# Altium schematic sheet Connectors.SchDoc: FIoT Rev 2.0
size A4; ApprovedBy: Patrick Magee; CheckedBy: Patrick Magee; Author: Patrick Magee; DrawnBy: Patrick Magee; Engineer: Patrick Magee; Organization: Lumen Electronics; DocumentNumber: 18072022 - 1; Revision: 0; SheetNumber: 1; SheetTotal: 8; ENG_APP_DATE: --/--/--; DSN_APP_DATE: --/--/--; CHK_APP_DATE: --/--/--; REV: 1.1
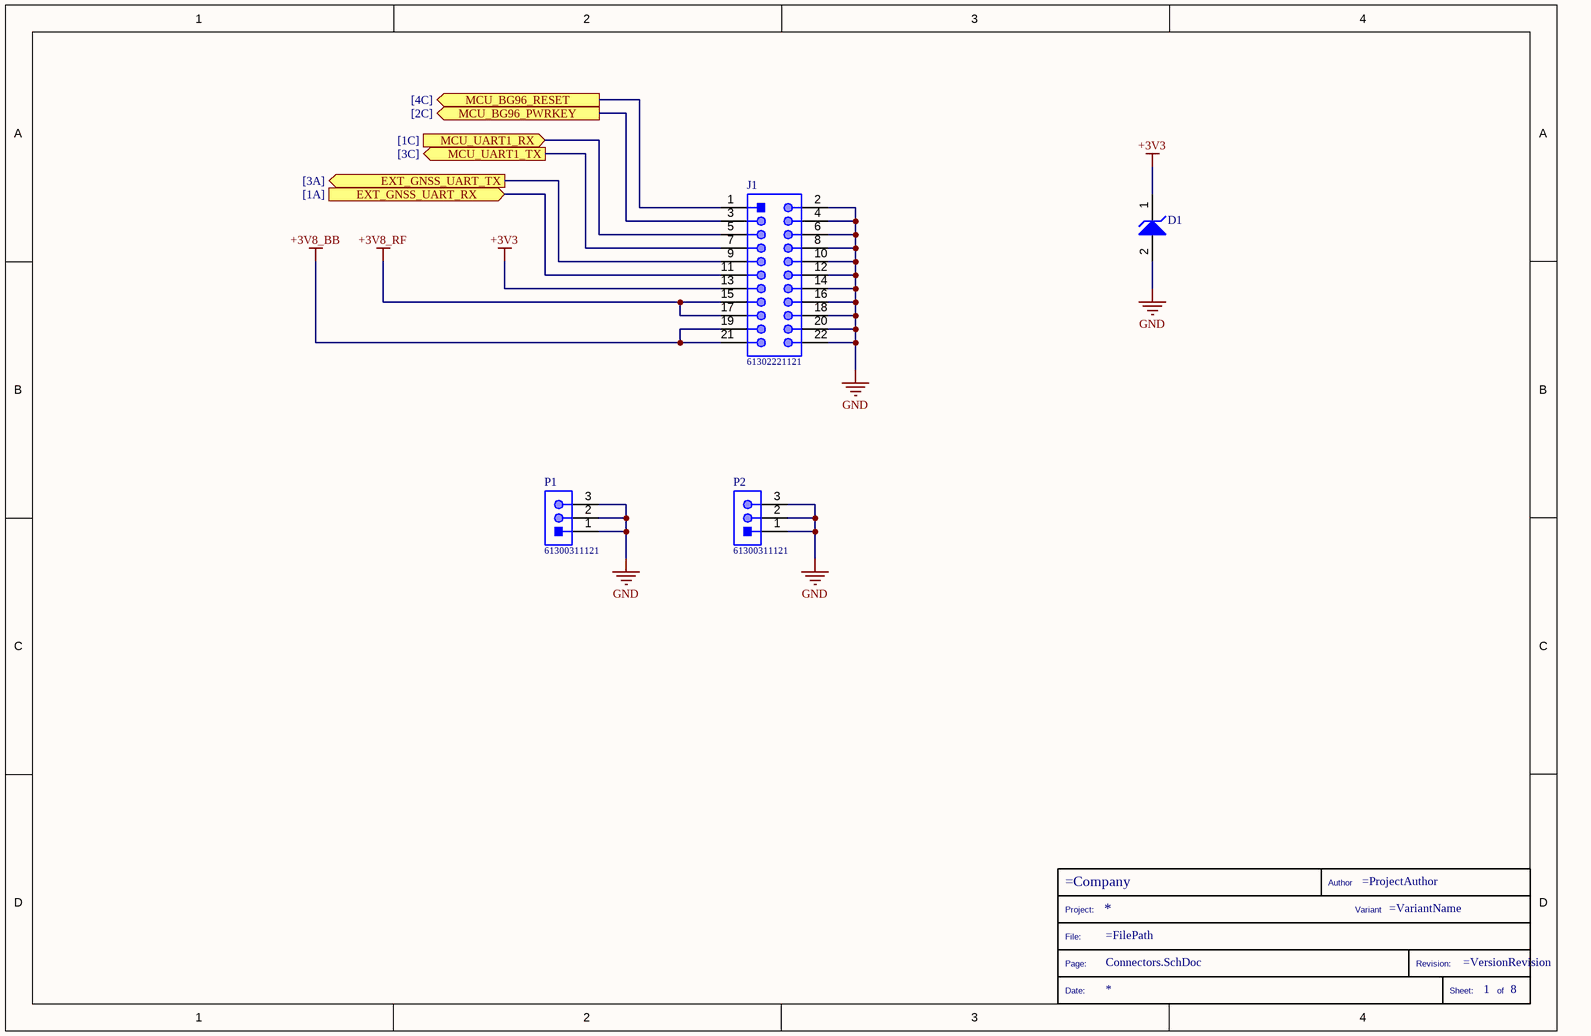
[diagram p0: Connectors.SchDoc]

## Parts
*  TitleBlock  (value not drawn)  (graphical)
D1  ESD9X3.3ST5G  [ONSC-SOD-923-2-514AA-01_V]  (value not drawn)
J1  61302221121  [61302221121]
P1  61300311121  [61300311121]
P2  61300311121  [61300311121]

## Ports
EXT_GNSS_UART_RX (in, see [1A]), EXT_GNSS_UART_TX (out, see [3A]), MCU_BG96_PWRKEY (out, see [2C]), MCU_BG96_RESET (out, see [4C]), MCU_UART1_RX (in, see [1C]), MCU_UART1_TX (out, see [3C])

## Nets
+3V3: D1.1(K) J1.13
+3V8_BB: J1.19 J1.21
+3V8_RF: J1.15 J1.17
GND: D1.2(A) J1.2 J1.4 J1.6 J1.8 J1.10 J1.12 J1.14 J1.16 J1.18 J1.20 J1.22 P1.1 P1.2 P1.3 P2.1 P2.2 P2.3
EXT_GNSS_UART_RX: J1.11 ; port EXT_GNSS_UART_RX
EXT_GNSS_UART_TX: J1.9 ; port EXT_GNSS_UART_TX
MCU_BG96_PWRKEY: J1.3 ; port MCU_BG96_PWRKEY
MCU_BG96_RESET: J1.1 ; port MCU_BG96_RESET
MCU_UART1_RX: J1.5 ; port MCU_UART1_RX
MCU_UART1_TX: J1.7 ; port MCU_UART1_TX

## Notes on the sheet
- DWG. NO.
- REV.
- SHT.
- THIS DOCUMENT AND THE DATA DISCLOSED HEREIN OR HEREWITH IS THE PROPERTY OF ALTIUM LIMITED AND MAY BE FREELY DISTRIBUTED IN WHOLE. NO RIGHTS ARE RESERVED OR EXPRESS OR IMPLIED WARANTEE GIVEN.
- REVISION
- DESCRIPTION
- DATE
- APPROVED
- ENG:
- APPROVALS
- PROJECT
- DSN:
- CHK:
- REFERENCE DOCUMENTS
- PROJECT REVISION:
- TITLE
- DOCUMENT REVISION:
- DESIGN ITEM:
- BOM:
- FAB DWG:
- PCB DWG:
- ASSY DWG:
- SCALE:
- SIZE
- B
- CAGE CODE
- FILE NAME
- DWG NO.
- SHEET
- OF
- REV
- (in symbol TitleBlock) Author; Project:; Variant; File:; Page:; Revision:; Date:; Sheet:; of

## Library data of the parts
D1 = LPN00013: Transient Voltage Suppressor, Micro-Packaged Diode for ESD Protection, 2-Pin SOD-923, Pb-Free, Tape and Reel; Manufacturer 1: On Semiconductor; Manufacturer Part Number 1: ESD9X3.3ST5G; Supplier 1: Farnell; Supplier Part Number 1: 2627963; Lumen Part Number: LPN00013
J1 = LPN00011: THT Vertical Pin Header WR-PHD, Pitch 2.54 mm, Dual Row, 22 pins; Manufacturer 1: Wurth Elektronik; Manufacturer Part Number 1: 61302221121; Lumen Part Number: LPN00011
P1 P2 = LPN00010: THT Vertical Pin Header WR-PHD, Pitch 2.54 mm, Single Row, 3 pins; Manufacturer 1: Wurth Elektronik; Manufacturer Part Number 1: 61300311121; Lumen Part Number: LPN00010